# Altium schematic sheet Kasli-SOC_SFP.SchDoc: SFP
size 420 x 297 mm; EDA_Number: ARTIQ; Projet: ARTIQ/SINARA; CheckedBy: G.Kasprowicz; Author: F.Switakowski; CompanyName: WUT ISE; DrawnBy: F.Switakowski; Organization: WUT ISE; Address1: PW ISE; Address2: Nowowiejska 15/19 00-665 Warsaw; Address3: gkasprow@gmail.com; DocumentNumber: 11; Revision: 1; SheetNumber: 11; SheetTotal: 18; ModifiedBy: -; CheckedDate: -; Title2: cages; DivGrp: WUT ISE; Designer: G.Kasprowicz; ModifiedDate: -; ProjectName: Sensor Box
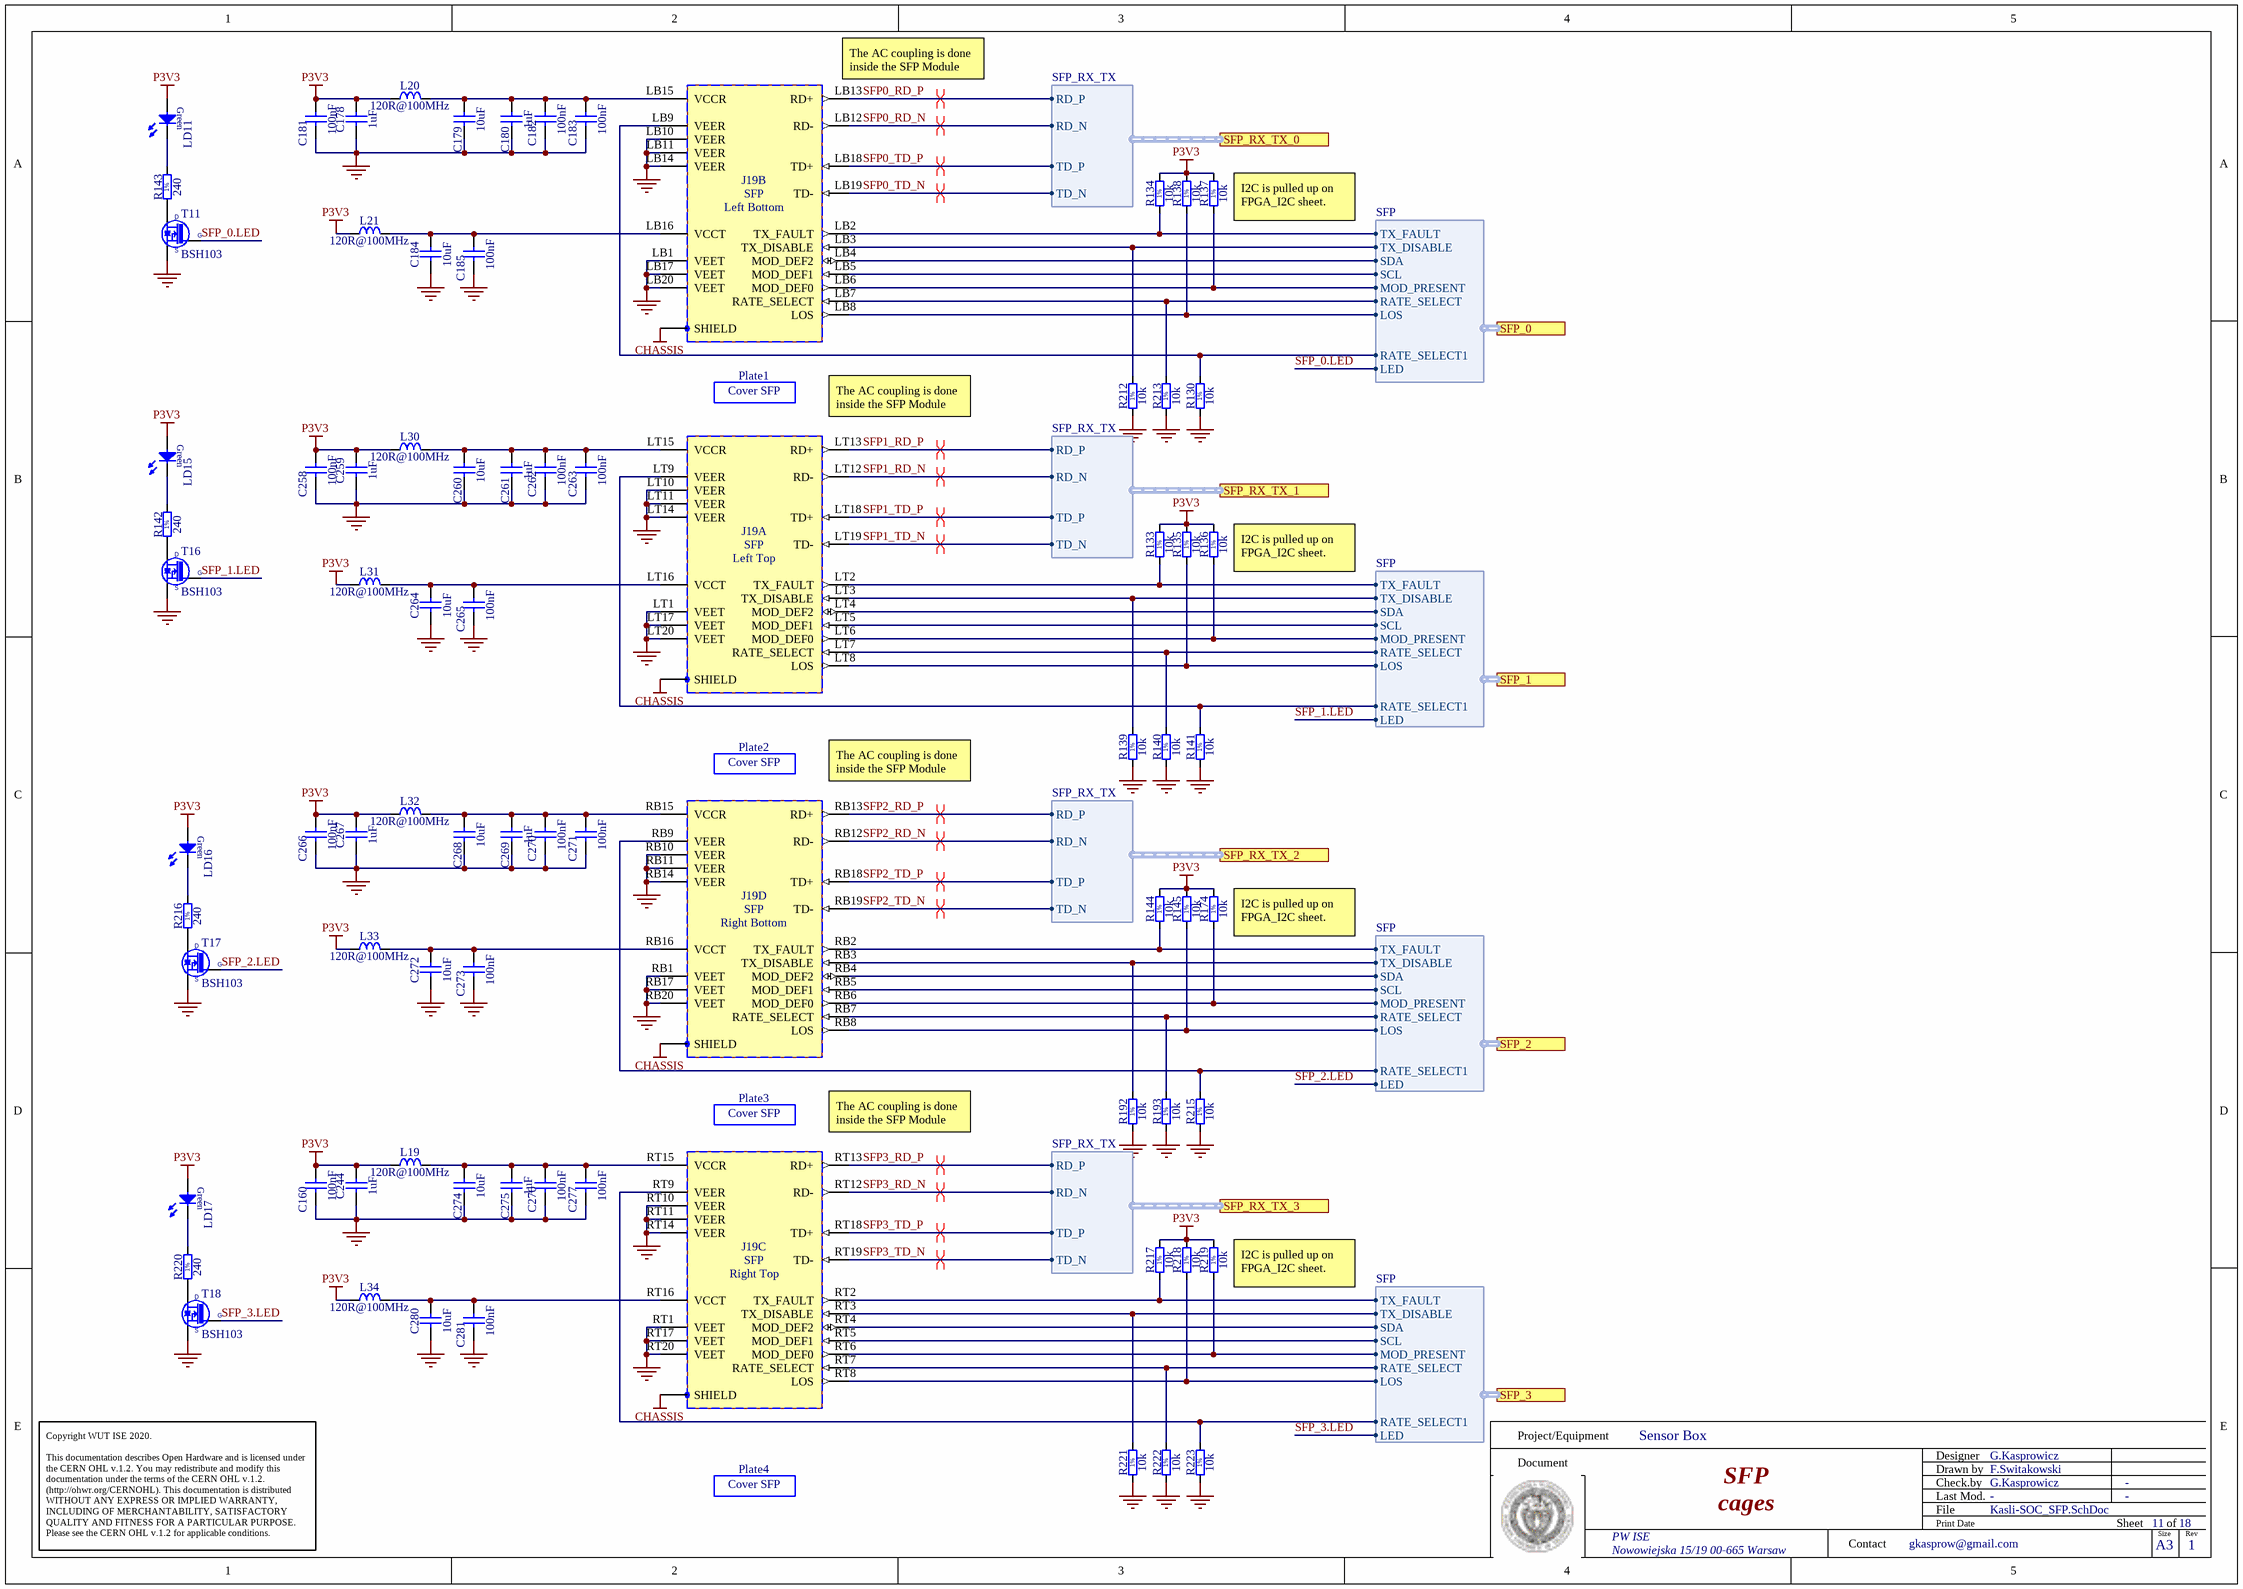
[diagram p0: Kasli-SOC_SFP.SchDoc]

## Parts
C160  100nF  [CAPC1005X55N]
C178  1uF  [CAPC1005X55N]
C179  10uF  [CAPC2012X95N]
C180  1uF  [CAPC1005X55N]
C181  100nF  [CAPC1005X55N]
C182  100nF  [CAPC1005X55N]
C183  100nF  [CAPC1005X55N]
C184  10uF  [CAPC2012X95N]
C185  100nF  [CAPC1005X55N]
C244  1uF  [CAPC1005X55N]
C258  100nF  [CAPC1005X55N]
C259  1uF  [CAPC1005X55N]
C260  10uF  [CAPC2012X95N]
C261  1uF  [CAPC1005X55N]
C262  100nF  [CAPC1005X55N]
C263  100nF  [CAPC1005X55N]
C264  10uF  [CAPC2012X95N]
C265  100nF  [CAPC1005X55N]
C266  100nF  [CAPC1005X55N]
C267  1uF  [CAPC1005X55N]
C268  10uF  [CAPC2012X95N]
C269  1uF  [CAPC1005X55N]
C270  100nF  [CAPC1005X55N]
C271  100nF  [CAPC1005X55N]
C272  10uF  [CAPC2012X95N]
C273  100nF  [CAPC1005X55N]
C274  10uF  [CAPC2012X95N]
C275  1uF  [CAPC1005X55N]
C276  100nF  [CAPC1005X55N]
C277  100nF  [CAPC1005X55N]
C280  10uF  [CAPC2012X95N]
C281  100nF  [CAPC1005X55N]
J19  SFP  [AMPHENOL_UE78B212700321]  (parts A,B,C,D of 4)
L19  120R@100MHz  [INDC1608X65N]
L20  120R@100MHz  [INDC1608X65N]
L21  120R@100MHz  [INDC1608X65N]
L30  120R@100MHz  [INDC1608X65N]
L31  120R@100MHz  [INDC1608X65N]
L32  120R@100MHz  [INDC1608X65N]
L33  120R@100MHz  [INDC1608X65N]
L34  120R@100MHz  [INDC1608X65N]
LD11  Green  [LED_AVAGO_HSME-C120]  (value not drawn)
LD15  Green  [LED_AVAGO_HSME-C120]  (value not drawn)
LD16  Green  [LED_AVAGO_HSME-C120]  (value not drawn)
LD17  Green  [LED_AVAGO_HSME-C120]  (value not drawn)
Plate1  Cover SFP  [AMPHENOL_U77A11108000P]
Plate2  Cover SFP  [AMPHENOL_U77A11108000P]
Plate3  Cover SFP  [AMPHENOL_U77A11108000P]
Plate4  Cover SFP  [AMPHENOL_U77A11108000P]
R130  10k  [RESC1005X40N]
R133  10k  [RESC1005X40N]
R134  10k  [RESC1005X40N]
R135  10k  [RESC1005X40N]
R136  10k  [RESC1005X40N]
R137  10k  [RESC1005X40N]
R138  10k  [RESC1005X40N]
R139  10k  [RESC1005X40N]
R140  10k  [RESC1005X40N]
R141  10k  [RESC1005X40N]
R142  240  [RESC1005X40N]
R143  240  [RESC1005X40N]
R144  10k  [RESC1005X40N]
R145  10k  [RESC1005X40N]
R174  10k  [RESC1005X40N]
R192  10k  [RESC1005X40N]
R193  10k  [RESC1005X40N]
R212  10k  [RESC1005X40N]
R213  10k  [RESC1005X40N]
R215  10k  [RESC1005X40N]
R216  240  [RESC1005X40N]
R217  10k  [RESC1005X40N]
R218  10k  [RESC1005X40N]
R219  10k  [RESC1005X40N]
R220  240  [RESC1005X40N]
R221  10k  [RESC1005X40N]
R222  10k  [RESC1005X40N]
R223  10k  [RESC1005X40N]
T11  BSH103  [SOT95P230X110-3N]
T16  BSH103  [SOT95P230X110-3N]
T17  BSH103  [SOT95P230X110-3N]
T18  BSH103  [SOT95P230X110-3N]

## Ports
SFP_0 (harness SFP), SFP_1 (harness SFP), SFP_2 (harness SFP), SFP_3 (harness SFP), SFP_RX_TX_0 (harness SFP_RX_TX), SFP_RX_TX_1 (harness SFP_RX_TX), SFP_RX_TX_2 (harness SFP_RX_TX), SFP_RX_TX_3 (harness SFP_RX_TX)

## Harnesses
SFP_RX_TX: RD_P, RD_N, TD_P, TD_N
SFP: TX_FAULT, LOS, MOD_PRESENT, TX_DISABLE, RATE_SELECT, LED, RATE_SELECT1, SDA, SCL

## Nets
CHASSIS: J19.SHIELD
GND: C160.1 C178.1 C179.1 C180.1 C181.1 C182.1 C183.1 C184.1 C185.1 C244.1 C258.1 C259.1 C260.1 C261.1 C262.1 C263.1 C264.1 C265.1 C266.1 C267.1 C268.1 C269.1 C270.1 C271.1 C272.1 C273.1 C274.1 C275.1 C276.1 C277.1 C280.1 C281.1 J19.LB1(VEET) J19.LB10(VEER) J19.LB11(VEER) J19.LB14(VEER) J19.LB17(VEET) J19.LB20(VEET) J19.LT1(VEET) J19.LT10(VEER) J19.LT11(VEER) J19.LT14(VEER) J19.LT17(VEET) J19.LT20(VEET) J19.RB1(VEET) J19.RB10(VEER) J19.RB11(VEER) J19.RB14(VEER) J19.RB17(VEET) J19.RB20(VEET) J19.RT1(VEET) J19.RT10(VEER) J19.RT11(VEER) J19.RT14(VEER) J19.RT17(VEET) J19.RT20(VEET) R130.1 R139.1 R140.1 R141.1 R192.1 R193.1 R212.1 R213.1 R215.1 R221.1 R222.1 R223.1 T11.2(S) T16.2(S) T17.2(S) T18.2(S)
P3V3: C160.2 C178.2 C181.2 C244.2 C258.2 C259.2 C266.2 C267.2 L19.1 L20.1 L21.1 L30.1 L31.1 L32.1 L33.1 L34.1 LD11.2(A) LD15.2(A) LD16.2(A) LD17.2(A) R133.2 R134.2 R135.2 R136.2 R137.2 R138.2 R144.2 R145.2 R174.2 R217.2 R218.2 R219.2
SFP0_RD_N: J19.LB12(RD-) ; port SFP_RX_TX_0.RD_N
SFP0_RD_P: J19.LB13(RD+) ; port SFP_RX_TX_0.RD_P
SFP0_TD_N: J19.LB19(TD-) ; port SFP_RX_TX_0.TD_N
SFP0_TD_P: J19.LB18(TD+) ; port SFP_RX_TX_0.TD_P
SFP1_RD_N: J19.LT12(RD-) ; port SFP_RX_TX_1.RD_N
SFP1_RD_P: J19.LT13(RD+) ; port SFP_RX_TX_1.RD_P
SFP1_TD_N: J19.LT19(TD-) ; port SFP_RX_TX_1.TD_N
SFP1_TD_P: J19.LT18(TD+) ; port SFP_RX_TX_1.TD_P
SFP2_RD_N: J19.RB12(RD-) ; port SFP_RX_TX_2.RD_N
SFP2_RD_P: J19.RB13(RD+) ; port SFP_RX_TX_2.RD_P
SFP2_TD_N: J19.RB19(TD-) ; port SFP_RX_TX_2.TD_N
SFP2_TD_P: J19.RB18(TD+) ; port SFP_RX_TX_2.TD_P
SFP3_RD_N: J19.RT12(RD-) ; port SFP_RX_TX_3.RD_N
SFP3_RD_P: J19.RT13(RD+) ; port SFP_RX_TX_3.RD_P
SFP3_TD_N: J19.RT19(TD-) ; port SFP_RX_TX_3.TD_N
SFP3_TD_P: J19.RT18(TD+) ; port SFP_RX_TX_3.TD_P
SFP_0.LED: T11.1(G) ; port SFP_0.LED
SFP_1.LED: T16.1(G) ; port SFP_1.LED
SFP_2.LED: T17.1(G) ; port SFP_2.LED
SFP_3.LED: T18.1(G) ; port SFP_3.LED
NetC179_2: C179.2 C180.2 C182.2 C183.2 J19.LB15(VCCR) L20.2
NetC184_2: C184.2 C185.2 J19.LB16(VCCT) L21.2
NetC260_2: C260.2 C261.2 C262.2 C263.2 J19.LT15(VCCR) L30.2
NetC264_2: C264.2 C265.2 J19.LT16(VCCT) L31.2
NetC268_2: C268.2 C269.2 C270.2 C271.2 J19.RB15(VCCR) L32.2
NetC272_2: C272.2 C273.2 J19.RB16(VCCT) L33.2
NetC274_2: C274.2 C275.2 C276.2 C277.2 J19.RT15(VCCR) L19.2
NetC280_2: C280.2 C281.2 J19.RT16(VCCT) L34.2
NetJ19_LB2: J19.LB2(TX_FAULT) R134.1 ; port SFP_0.TX_FAULT
NetJ19_LB3: J19.LB3(TX_DISABLE) R212.2 ; port SFP_0.TX_DISABLE
NetJ19_LB4: J19.LB4(MOD_DEF2) ; port SFP_0.SDA
NetJ19_LB5: J19.LB5(MOD_DEF1) ; port SFP_0.SCL
NetJ19_LB6: J19.LB6(MOD_DEF0) R137.1 ; port SFP_0.MOD_PRESENT
NetJ19_LB7: J19.LB7(RATE_SELECT) R213.2 ; port SFP_0.RATE_SELECT
NetJ19_LB8: J19.LB8(LOS) R138.1 ; port SFP_0.LOS
NetJ19_LB9: J19.LB9(VEER) R130.2 ; port SFP_0.RATE_SELECT1
NetJ19_LT2: J19.LT2(TX_FAULT) R133.1 ; port SFP_1.TX_FAULT
NetJ19_LT3: J19.LT3(TX_DISABLE) R139.2 ; port SFP_1.TX_DISABLE
NetJ19_LT4: J19.LT4(MOD_DEF2) ; port SFP_1.SDA
NetJ19_LT5: J19.LT5(MOD_DEF1) ; port SFP_1.SCL
NetJ19_LT6: J19.LT6(MOD_DEF0) R136.1 ; port SFP_1.MOD_PRESENT
NetJ19_LT7: J19.LT7(RATE_SELECT) R140.2 ; port SFP_1.RATE_SELECT
NetJ19_LT8: J19.LT8(LOS) R135.1 ; port SFP_1.LOS
NetJ19_LT9: J19.LT9(VEER) R141.2 ; port SFP_1.RATE_SELECT1
NetJ19_RB2: J19.RB2(TX_FAULT) R144.1 ; port SFP_2.TX_FAULT
NetJ19_RB3: J19.RB3(TX_DISABLE) R192.2 ; port SFP_2.TX_DISABLE
NetJ19_RB4: J19.RB4(MOD_DEF2) ; port SFP_2.SDA
NetJ19_RB5: J19.RB5(MOD_DEF1) ; port SFP_2.SCL
NetJ19_RB6: J19.RB6(MOD_DEF0) R174.1 ; port SFP_2.MOD_PRESENT
NetJ19_RB7: J19.RB7(RATE_SELECT) R193.2 ; port SFP_2.RATE_SELECT
NetJ19_RB8: J19.RB8(LOS) R145.1 ; port SFP_2.LOS
NetJ19_RB9: J19.RB9(VEER) R215.2 ; port SFP_2.RATE_SELECT1
NetJ19_RT2: J19.RT2(TX_FAULT) R217.1 ; port SFP_3.TX_FAULT
NetJ19_RT3: J19.RT3(TX_DISABLE) R221.2 ; port SFP_3.TX_DISABLE
NetJ19_RT4: J19.RT4(MOD_DEF2) ; port SFP_3.SDA
NetJ19_RT5: J19.RT5(MOD_DEF1) ; port SFP_3.SCL
NetJ19_RT6: J19.RT6(MOD_DEF0) R219.1 ; port SFP_3.MOD_PRESENT
NetJ19_RT7: J19.RT7(RATE_SELECT) R222.2 ; port SFP_3.RATE_SELECT
NetJ19_RT8: J19.RT8(LOS) R218.1 ; port SFP_3.LOS
NetJ19_RT9: J19.RT9(VEER) R223.2 ; port SFP_3.RATE_SELECT1
NetLD11_1: LD11.1(C) R143.2
NetLD15_1: LD15.1(C) R142.2
NetLD16_1: LD16.1(C) R216.2
NetLD17_1: LD17.1(C) R220.2
NetR142_1: R142.1 T16.3(D)
NetR143_1: R143.1 T11.3(D)
NetR216_1: R216.1 T17.3(D)
NetR220_1: R220.1 T18.3(D)

## Layout directives
differential pair; differential pair class Diff_100Ohm: SFP0_RD_N, SFP0_RD_P, SFP0_TD_N, SFP0_TD_P, SFP1_RD_N, SFP1_RD_P, SFP1_TD_N, SFP1_TD_P, SFP2_RD_N, SFP2_RD_P, SFP2_TD_N, SFP2_TD_P, SFP3_RD_N, SFP3_RD_P, SFP3_TD_N, SFP3_TD_P

## Notes on the sheet
- (near J19) The AC coupling is done inside the SFP Module
- (near R137) I2C is pulled up on FPGA_I2C sheet.
- (near R136) I2C is pulled up on FPGA_I2C sheet.
- (near R174) I2C is pulled up on FPGA_I2C sheet.
- (near R219) I2C is pulled up on FPGA_I2C sheet.
- Project/Equipment
- Document
- Designer
- Drawn by
- Check.by
- Copyright WUT ISE 2020.
  This documentation describes Open Hardware and is licensed under the CERN OHL v.1.2. You may redistribute and modify this documentation under the terms of the CERN OHL v.1.2. (http://ohwr.org/CERNOHL). This documentation is distributed WITHOUT ANY EXPRESS OR IMPLIED WARRANTY, INCLUDING OF MERCHANTABILITY, SATISFACTORY QUALITY AND FITNESS FOR A PARTICULAR PURPOSE. Please see the CERN OHL v.1.2 for applicable conditions.
- Contact
- File
- Last Mod.
- Print Date
- Sheet
- Size
- A3
- of
- Rev
- (in symbol AMPHENOL_UE78B212700321, part A) Left Top
- (in symbol AMPHENOL_UE78B212700321, part B) Left Bottom
- (in symbol AMPHENOL_UE78B212700321, part C) Right Top
- (in symbol AMPHENOL_UE78B212700321, part D) Right Bottom
- (in symbol R0402_10K_1%_0.0625W_100PPM) 1%
- (in symbol R0402_240R_1%_0.0625W_100PPM) 1%

## Library data of the parts
C160 C181-C183 C185 C258 C262 C263 C265 C266 C270 C271 C273 C276 C277 C281 = CC0402_100NF_16V_10%_X7R: Non-polarised capacitor; Part Description: SMD Multilayer Chip Ceramic Capacitor; Manufacturer: GENERIC; Manufacturer1 Part Number: GRM155R71C104KA88D; Voltage: 16V; TC: X7R; Tolerance: ±10%; Part Number: CC0402_100NF_16V_10%_X7R; Component Kind: Standard; Component Type: Standard; Pin Count: 2; Value: 100nF; Status: Not Recommended; Manufacturer Part Number: CC0402_100NF_16V_10%_X7R; Case: 0402; Mounted: Yes; Socket: No; SMD: Yes; Sense: No; Manufacturer1 Example: MURATA; Manufacturer1 ComponentHeight: 0.55mm; HelpURL: \\cern.ch\dfs\Applications\Altium\Datasheets\CC0402_X7R_MURATA_GRM.pdf; Author: CERN DEM JLC; CreateDate: 05.12.2013; LatestRevisionDate: 03.12.2007
C178 C180 C244 C259 C261 C267 C269 C275 = CC0402_1UF_16V_10%_X5R: Non-polarised capacitor; Part Description: SMD Multilayer Chip Ceramic Capacitor; Manufacturer: GENERIC; Manufacturer1 Part Number: C1005X5R1C105KT; Voltage: 16V; TC: X5R; Tolerance: ±10%; Part Number: CC0402_1UF_16V_10%_X5R; Component Kind: Standard; Component Type: Standard; Pin Count: 2; Value: 1uF; Status: Preferred; Manufacturer Part Number: CC0402_1UF_16V_10%_X5R; Case: 0402; Mounted: Yes; Socket: No; SMD: Yes; Sense: No; Manufacturer1 Example: TDK; Manufacturer1 ComponentHeight: 0.55mm; HelpURL: \\cern.ch\dfs\Applications\Altium\Datasheets\CC0402_X5R_TDK_C.pdf; Author: CERN DEM JLC; CreateDate: 2012-10-25; LatestRevisionDate: 2012-10-25
C179 C184 C260 C264 C268 C272 C274 C280 = CC0805_10UF_25V_10%_X5R: Non-polarised capacitor; Part Description: SMD Multilayer Chip Ceramic Capacitor; Manufacturer: GENERIC; Manufacturer1 Part Number: GRM219R61E106KA12D; Voltage: 25V; TC: X5R; Tolerance: ±10%; Part Number: CC0805_10UF_25V_10%_X5R; Component Kind: Standard; Component Type: Standard; Pin Count: 2; Value: 10uF; Status: Preferred; Manufacturer Part Number: CC0805_10UF_25V_10%_X5R; Case: 0805; Mounted: Yes; Socket: No; SMD: Yes; Sense: No; Manufacturer1 Example: MURATA; Manufacturer1 ComponentHeight: 0.95mm; HelpURL: \\cern.ch\dfs\Applications\Altium\Datasheets\CC0805_X5R_MURATA_GRM.pdf; Author: CERN DEM JLC; CreateDate: 25.10.2012; LatestRevisionDate: 06.09.2016
J19 = AMPHENOL_UE78B212700321: 20 Position SFP  Connector (Small Form-factor Pluggable); Part Description: 2x2 SFP Cage (Small Form-factor Pluggable) with 4x20 Positions Integrated Receptacles (Press Fit Tails); Part Number: AMPHENOL_UE78B212700321; Component Kind: Standard; Component Type: Standard; Pin Count: 110; Family: SFP; Mounted: Yes; Socket: No; SMD: No; PressFit: Yes; Sense: No; Status: None; Manufacturer: AMPHENOL; Manufacturer Part Number: UE78B212700321; ComponentHeight: 25.45mm; HelpURL: \\cern.ch\dfs\Applications\Altium\Datasheets\AMPHENOL_UE78B212700321.pdf; Author: CERN DEM BC; CreateDate: 25.10.2019; LatestRevisionDate: 25.10.2019
L19-L21 L30-L34 = IND0603_MURATA_BLM18SG121TN1D: Inductor; Part Description: SMD EMIFIL Suppression Chip Ferrite Bead; Manufacturer: MURATA; Power: 3A; Resistance: 0.025R; Tolerance: ±25%; Part Number: IND0603_MURATA_BLM18SG121TN1D; Component Kind: Standard; Component Type: Standard; Pin Count: 2; Value: 120R@100MHz; Status: None; Manufacturer Part Number: BLM18SG121TN1D; Case: 0603; Mounted: Yes; Socket: No; SMD: Yes; Sense: No; ComponentHeight: 0.65mm; HelpURL: \\cern.ch\dfs\Applications\Altium\Datasheets\IND0603_MURATA_BLM18S.pdf; Author: CERN DEM JLC; CreateDate: 23.07.2014; LatestRevisionDate: 23.07.2014
LD11 LD15-LD17 = LED_AVAGO_HSME-C120: LED Green 1C 2A; Part Description: High Performance Right Angle Chip Green LED; Manufacturer: AVAGO TECHNOLOGIES; PressFit: No; Bonding: No; Part Number: LED_AVAGO_HSME-C120; Component Kind: Standard; Component Type: Standard; Color: Green; PackageDescription: Green Chip LED, 2-Leads, Body 1.7x1.1mm, Side Emitting Package; Manufacturer Part Number: HSME-C120; Pin Count: 2; Mounted: Yes; Socket: No; SMD: Yes; Sense: No; ComponentHeight: 0.7mm; HelpURL: \\cern.ch\dfs\Applications\Altium\Datasheets\LED_AVAGO_HSME-C120.pdf; ComponentLink1URL: \\cern.ch\dfs\Applications\Altium\Datasheets\LED_AVAGO_HSME-C110_DESIGN-GUIDE.pdf; ComponentLink1Description: Design Guide; Author: CERN DEM JMW; CreateDate: 22.07.2009; LatestRevisionDate: 20.06.2012
Plate1-Plate4 = AMPHENOL_U77A11108000P: Plastic Dust Cover SFP Cage; PressFit: No; Part Number: AMPHENOL_U77A11108000P; Component Kind: Accessories; Component Type: Standard; Pin Count: 0; PackageDescription: Plastic Dust Cover SFP Cage; Mounted: Yes; Socket: No; SMD: No; Sense: No; Status: None; Value: Cover SFP; Part Description: Plastic Dust Cover SFP Cage; Manufacturer: AMPHENOL; Manufacturer Part Number: U77A11108000P; ComponentHeight: 10.2mm; HelpURL: \\cern.ch\dfs\Applications\Altium\Datasheets\AMPHENOL_U77A11108000P.pdf; Author: CERN DEM BC; CreateDate: 28.10.2019; LatestRevisionDate: 28.10.2019
R130 R133-R141 R144 R145 R174 R192 R193 R212 R213 R215 R217-R219 R221-R223 = R0402_10K_1%_0.0625W_100PPM: Resistor - 1%; Part Description: General Purpose Thick Film Chip Resistor; Manufacturer: GENERIC; Manufacturer1 Part Number: 232270671003L; TC: ±100ppm/°C; PressFit: No; Part Number: R0402_10K_1%_0.0625W_100PPM; Component Kind: Standard; Component Type: Standard; Pin Count: 2; Value: 10k; Status: Not Recommended; Power: 0.0625W; Tolerance: ±1%; Manufacturer Part Number: R0402_10K_1%_0.0625W_100PPM; Case: 0402; Mounted: Yes; Sense: No; Socket: No; SMD: Yes; Manufacturer1 Example: YAGEO PHYCOMP; Manufacturer1 ComponentHeight: 0.4mm; HelpURL: \\cern.ch\dfs\Applications\Altium\Datasheets\R0402_Phycomp_RC0402.pdf; Author: CERN DEM JLC; CreateDate: 03.12.2007; LatestRevisionDate: 17.10.2012
R142 R143 R216 R220 = R0402_240R_1%_0.0625W_100PPM: Resistor - 1%; Part Description: General Purpose Thick Film Chip Resistor; Manufacturer: GENERIC; Manufacturer1 Part Number: 232270672401L; TC: ±100ppm/°C; PressFit: No; Part Number: R0402_240R_1%_0.0625W_100PPM; Component Kind: Standard; Component Type: Standard; Pin Count: 2; Value: 240; Status: Not Recommended; Power: 0.0625W; Tolerance: ±1%; Manufacturer Part Number: R0402_240R_1%_0.0625W_100PPM; Case: 0402; Mounted: Yes; Sense: No; Socket: No; SMD: Yes; Manufacturer1 Example: YAGEO PHYCOMP; Manufacturer1 ComponentHeight: 0.4mm; HelpURL: \\cern.ch\dfs\Applications\Altium\Datasheets\R0402_Phycomp_RC0402.pdf; Author: CERN DEM JLC; CreateDate: 03.12.2007; LatestRevisionDate: 17.10.2012
T11 T16-T18 = BSH103: N-CHANNEL MOSFET WITH DIODE; Part Description: 30V 850mA N-Channel Enhancement Mode Field-Effect Transistor; Manufacturer: NEXPERIA; PressFit: No; Bonding: No; Part Number: BSH103; Component Kind: Standard; Component Type: Standard; Device: BSH103; PackageDescription: SOT23, 3 pin, Pitch 0.95mm - 1.3mm W X 2.9mm L X 1.1mm H, IPC Medium Density; Manufacturer Part Number: BSH103; Pin Count: 3; Case: SOT23-3; Mounted: Yes; Socket: No; SMD: Yes; Sense: No; ComponentHeight: 1.1mm; HelpURL: \\cern.ch\dfs\Applications\Altium\Datasheets\BSH103.pdf; Author: CERN DEM JLC; CreateDate: 16.03.2010; LatestRevisionDate: 20.06.2017